# Altium schematic sheet main.SchDoc
size A3; Organization: Altium Limited; Address1: L3, 12a Rodborough Rd; Address2: Frenchs Forest; Address3: NSW; Address4: Australia 2086; SheetNumber: 1; SheetTotal: 1
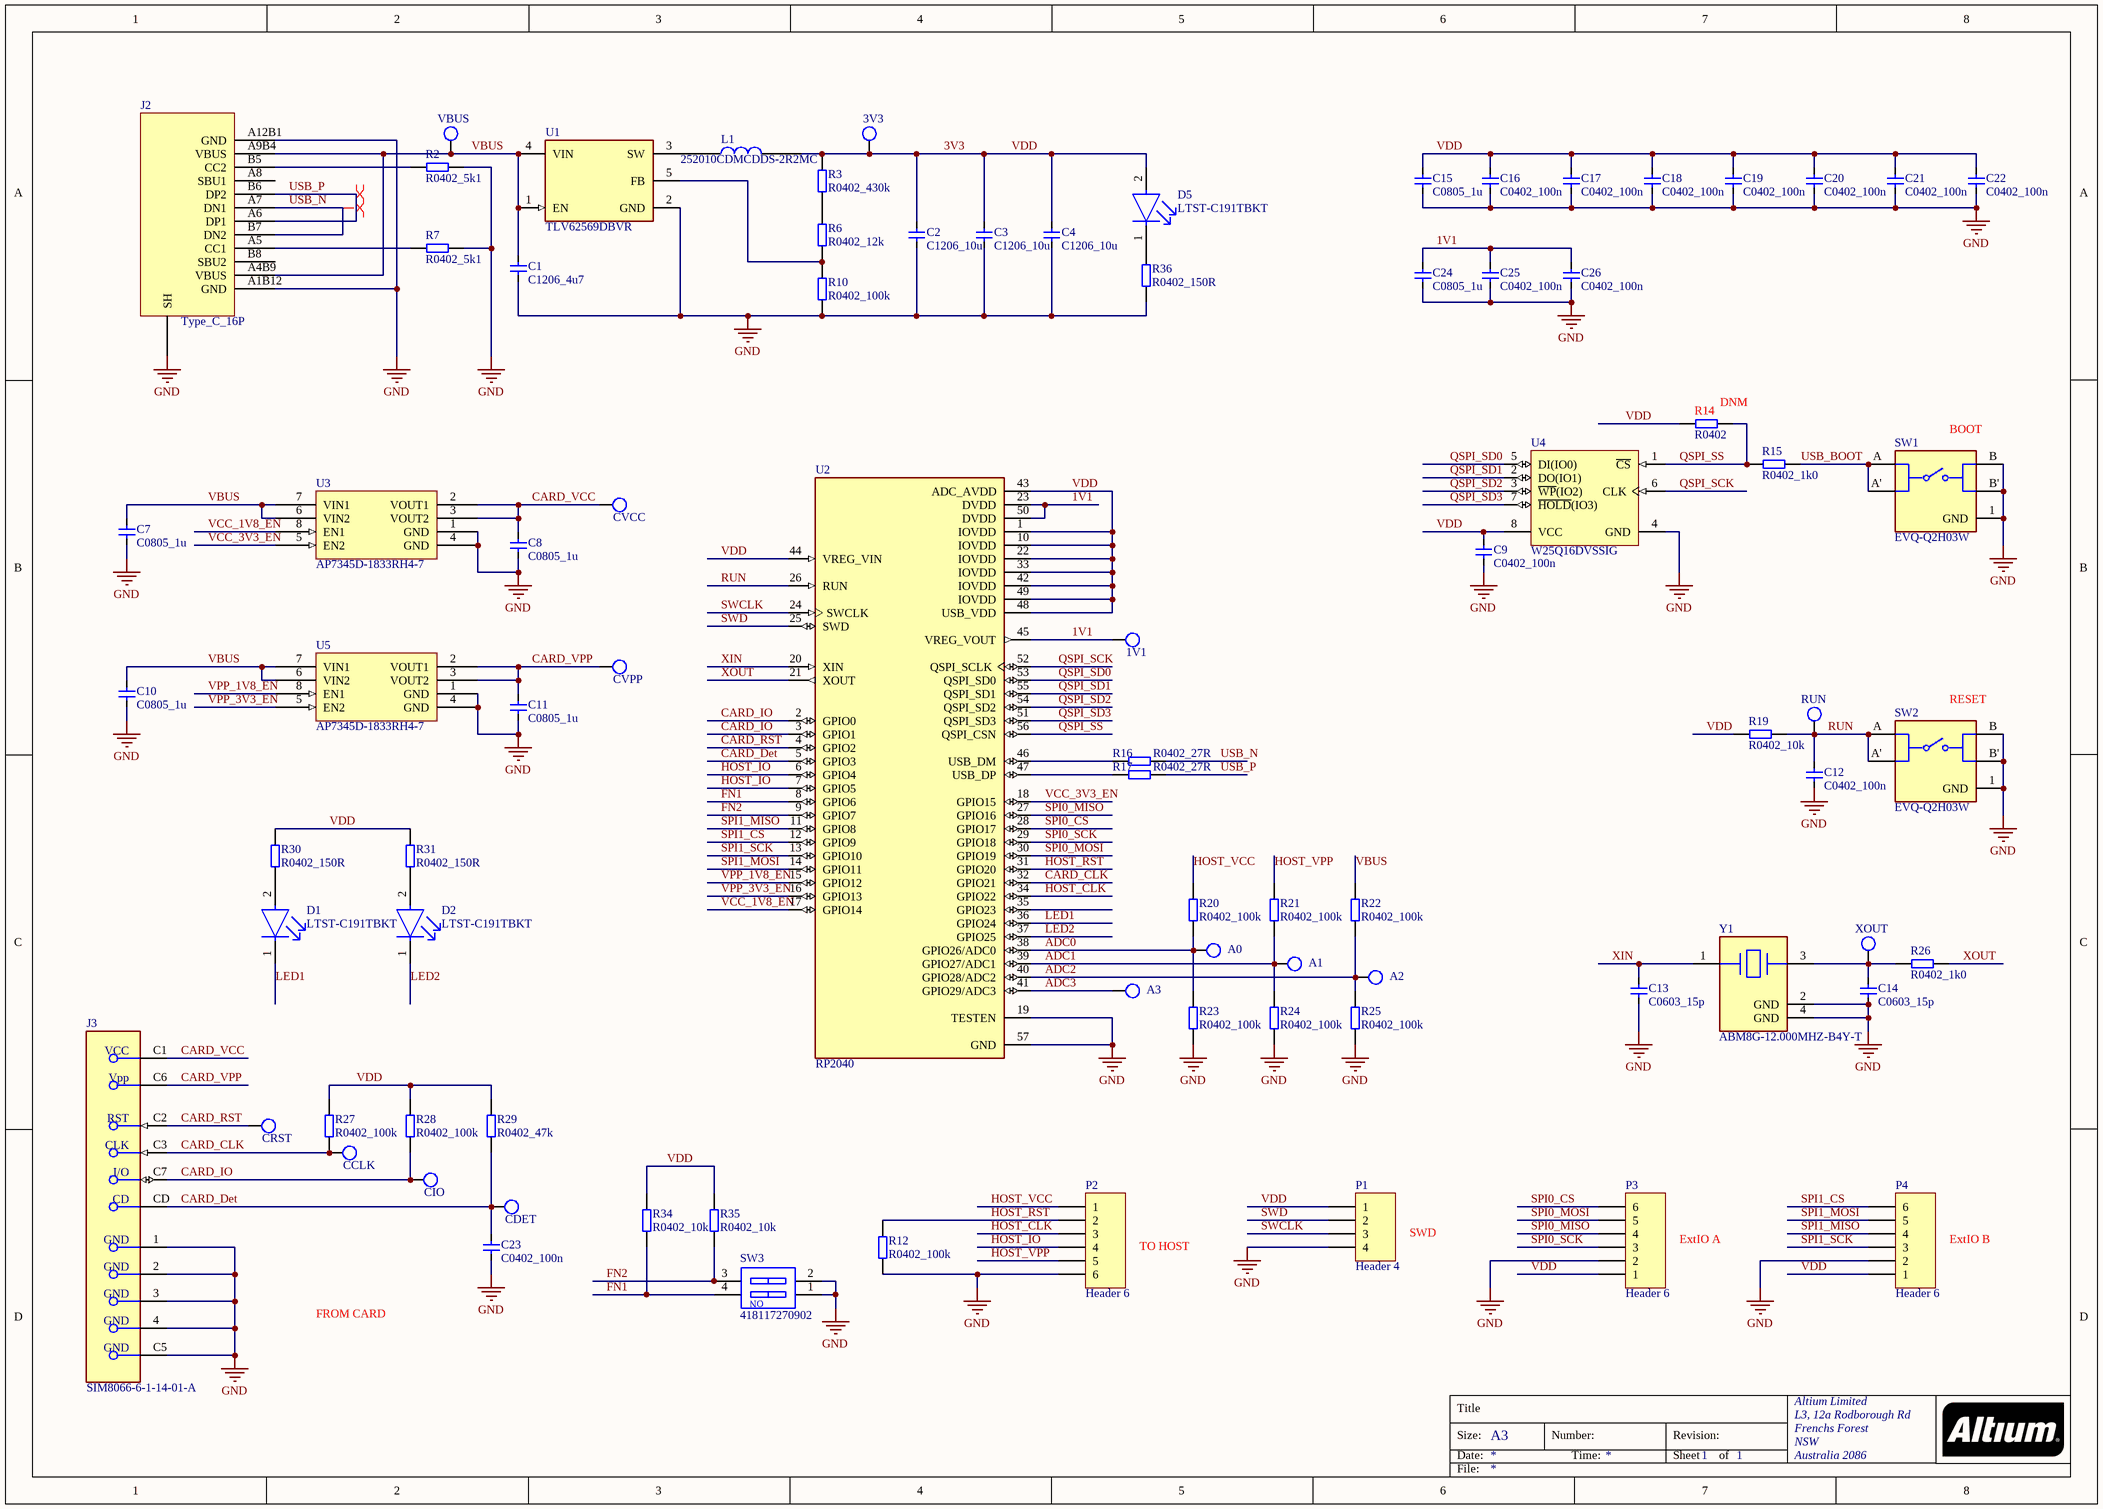
[diagram p0: main.SchDoc]

## Parts
1V1  TestPin 1.2R 0.3R  [TestPin_1.2R_0.3R]  (value not drawn)
3V3  TestPin 1.2R 0.3R  [TestPin_1.2R_0.3R]  (value not drawn)
A0  TestPin 1.2R 0.3R  [TestPin_1.2R_0.3R]  (value not drawn)
A1  TestPin 1.2R 0.3R  [TestPin_1.2R_0.3R]  (value not drawn)
A2  TestPin 1.2R 0.3R  [TestPin_1.2R_0.3R]  (value not drawn)
A3  TestPin 1.2R 0.3R  [TestPin_1.2R_0.3R]  (value not drawn)
C1  C1206_4u7  [C1206]
C2  C1206_10u  [C1206]
C3  C1206_10u  [C1206]
C4  C1206_10u  [C1206]
C7  C0805_1u  [C0805]
C8  C0805_1u  [C0805]
C9  C0402_100n  [C0402]
C10  C0805_1u  [C0805]
C11  C0805_1u  [C0805]
C12  C0402_100n  [C0402]
C13  C0603_15p  [C0603]
C14  C0603_15p  [C0603]
C15  C0805_1u  [C0805]
C16  C0402_100n  [C0402]
C17  C0402_100n  [C0402]
C18  C0402_100n  [C0402]
C19  C0402_100n  [C0402]
C20  C0402_100n  [C0402]
C21  C0402_100n  [C0402]
C22  C0402_100n  [C0402]
C23  C0402_100n  [C0402]
C24  C0805_1u  [C0805]
C25  C0402_100n  [C0402]
C26  C0402_100n  [C0402]
CCLK  TestPin 1.2R 0.3R  [TestPin_1.2R_0.3R]  (value not drawn)
CDET  TestPin 1.2R 0.3R  [TestPin_1.2R_0.3R]  (value not drawn)
CIO  TestPin 1.2R 0.3R  [TestPin_1.2R_0.3R]  (value not drawn)
CRST  TestPin 1.2R 0.3R  [TestPin_1.2R_0.3R]  (value not drawn)
CVCC  TestPin 1.2R 0.3R  [TestPin_1.2R_0.3R]  (value not drawn)
CVPP  TestPin 1.2R 0.3R  [TestPin_1.2R_0.3R]  (value not drawn)
D1  LTST-C191TBKT  [FP-LTST-C191TBKT-MFG]
D2  LTST-C191TBKT  [FP-LTST-C191TBKT-MFG]
D5  LTST-C191TBKT  [FP-LTST-C191TBKT-MFG]
J2  Type_C_16P  [Type_C_16P]
J3  SIM8066-6-1-14-01-A  [FP-SIM8066-6-1-14-01-A-MFG]
L1  252010CDMCDDS-2R2MC  [INDC2520X10N]
P1  Header 4  [HDR1X4]
P2  Header 6  [HDR1X6]
P3  Header 6  [HDR1X6]
P4  Header 6  [HDR1X6]
R2  R0402_5k1  [R0402]
R3  R0402_430k  [R0402]
R6  R0402_12k  [R0402]
R7  R0402_5k1  [R0402]
R10  R0402_100k  [R0402]
R12  R0402_100k  [R0402]
R14  R0402  [R0402]
R15  R0402_1k0  [R0402]
R16  R0402_27R  [R0402]
R17  R0402_27R  [R0402]
R19  R0402_10k  [R0402]
R20  R0402_100k  [R0402]
R21  R0402_100k  [R0402]
R22  R0402_100k  [R0402]
R23  R0402_100k  [R0402]
R24  R0402_100k  [R0402]
R25  R0402_100k  [R0402]
R26  R0402_1k0  [R0402]
R27  R0402_100k  [R0402]
R28  R0402_100k  [R0402]
R29  R0402_47k  [R0402]
R30  R0402_150R  [R0402]
R31  R0402_150R  [R0402]
R34  R0402_10k  [R0402]
R35  R0402_10k  [R0402]
R36  R0402_150R  [R0402]
RUN  TestPin 1.2R 0.3R  [TestPin_1.2R_0.3R]  (value not drawn)
SW1  EVQ-Q2H03W  [FP-EVQ-Q2H03W-MFG]
SW2  EVQ-Q2H03W  [FP-EVQ-Q2H03W-MFG]
SW3  418117270902  [418117270902]
U1  TLV62569DBVR  [FP-DBV0005A-MFG]
U2  RP2040  [QFN40P700X700X90-57N]
U3  AP7345D-1833RH4-7  [SON127P600-8N]
U4  W25Q16DVSSIG  [WINB-W25Q16DVSSIG-8_M]
U5  AP7345D-1833RH4-7  [SON127P600-8N]
VBUS  TestPin 1.2R 0.3R  [TestPin_1.2R_0.3R]  (value not drawn)
XOUT  TestPin 1.2R 0.3R  [TestPin_1.2R_0.3R]  (value not drawn)
Y1  ABM8G-12.000MHZ-B4Y-T  [FP-ABM8G-MFG]

## Nets
GND: C1.2 C2.2 C3.2 C4.2 C7.2 C8.2 C9.2 C10.2 C11.2 C12.2 C13.2 C14.2 C15.2 C16.2 C17.2 C18.2 C19.2 C20.2 C21.2 C22.2 C23.2 C24.2 C25.2 C26.2 J2.0(SH) J2.A1B12(GND) J2.A12B1(GND) J3.1(GND) J3.2(GND) J3.3(GND) J3.4(GND) J3.C5(GND) P1.4 P2.6 P3.2 P4.2 R2.2 R7.2 R10.1 R12.1 R23.1 R24.1 R25.1 R36.1 SW1.1(GND) SW1.B SW1.B' SW2.1(GND) SW2.B SW2.B' SW3.1 SW3.2 U1.2(GND) U2.19(TESTEN) U2.57(GND) U3.1(GND) U3.4(GND) U4.4(GND) U5.1(GND) U5.4(GND) Y1.2(GND) Y1.4(GND)
1V1: 1V1.0 C24.1 C25.1 C26.1 U2.23(DVDD) U2.45(VREG_VOUT) U2.50(DVDD)
3V3: 3V3.0 C2.1 C3.1 C4.1 C9.1 C15.1 C16.1 C17.1 C18.1 C19.1 C20.1 C21.1 C22.1 D5.2(A) L1.2 P1.1 P3.1 P4.1 R3.2 R14.1 R19.1 R27.2 R28.2 R29.2 R30.2 R31.2 R34.2 R35.2 U2.1(IOVDD) U2.10(IOVDD) U2.22(IOVDD) U2.33(IOVDD) U2.42(IOVDD) U2.43(ADC_AVDD) U2.44(VREG_VIN) U2.48(USB_VDD) U2.49(IOVDD) U4.8(VCC)  [also labelled VDD]
ADC0: A0.0 R20.1 R23.2 U2.38(GPIO26/ADC0)
ADC1: A1.0 R21.1 R24.2 U2.39(GPIO27/ADC1)
ADC2: A2.0 R22.1 R25.2 U2.40(GPIO28/ADC2)
ADC3: A3.0 U2.41(GPIO29/ADC3)
CARD_CLK: CCLK.0 J3.C3(CLK) R27.1 U2.32(GPIO21)
CARD_Det: C23.1 CDET.0 J3.CD R29.1 U2.5(GPIO3)
CARD_IO: CIO.0 J3.C7(I/O) R28.1 U2.2(GPIO0) U2.3(GPIO1)
CARD_RST: CRST.0 J3.C2(RST) U2.4(GPIO2)
CARD_VCC: C8.1 CVCC.0 J3.C1(VCC) U3.2(VOUT1) U3.3(VOUT2)
CARD_VPP: C11.1 CVPP.0 J3.C6(Vpp) U5.2(VOUT1) U5.3(VOUT2)
FN1: R34.1 SW3.4 U2.8(GPIO6)
FN2: R35.1 SW3.3 U2.9(GPIO7)
HOST_CLK: P2.3 U2.34(GPIO22)
HOST_IO: P2.4 U2.6(GPIO4) U2.7(GPIO5)
HOST_RST: P2.2 R12.2 U2.31(GPIO20)
HOST_VCC: P2.1 R20.2
HOST_VPP: P2.5 R21.2
LED1: D1.1(C) U2.36(GPIO24)
LED2: D2.1(C) U2.37(GPIO25)
QSPI_SCK: U2.52(QSPI_SCLK) U4.6(CLK)
QSPI_SD0: U2.53(QSPI_SD0) U4.5(DI(IO0))
QSPI_SD1: U2.55(QSPI_SD1) U4.2(DO(IO1))
QSPI_SD2: U2.54(QSPI_SD2) U4.3(~{WP}(IO2))
QSPI_SD3: U2.51(QSPI_SD3) U4.7(~{HOLD}(IO3))
QSPI_SS: R14.2 R15.1 U2.56(QSPI_CSN) U4.1(~{CS})
RUN: C12.1 R19.2 RUN.0 SW2.A SW2.A' U2.26(RUN)
SPI0_CS: P3.6 U2.28(GPIO17)
SPI0_MISO: P3.4 U2.27(GPIO16)
SPI0_MOSI: P3.5 U2.30(GPIO19)
SPI0_SCK: P3.3 U2.29(GPIO18)
SPI1_CS: P4.6 U2.12(GPIO9)
SPI1_MISO: P4.4 U2.11(GPIO8)
SPI1_MOSI: P4.5 U2.14(GPIO11)
SPI1_SCK: P4.3 U2.13(GPIO10)
SWCLK: P1.3 U2.24(SWCLK)
SWD: P1.2 U2.25(SWD)
USB_BOOT: R15.2 SW1.A SW1.A'
USB_N: J2.A7(DN1) J2.B7(DN2) R16.2
USB_P: J2.A6(DP1) J2.B6(DP2) R17.2
VBUS: C1.1 C7.1 C10.1 J2.A4B9(VBUS) J2.A9B4(VBUS) R22.2 U1.1(EN) U1.4(VIN) U3.6(VIN2) U3.7(VIN1) U5.6(VIN2) U5.7(VIN1) VBUS.0
VCC_1V8_EN: U2.17(GPIO14) U3.8(EN1)
VCC_3V3_EN: U2.18(GPIO15) U3.5(EN2)
VPP_1V8_EN: U2.15(GPIO12) U5.8(EN1)
VPP_3V3_EN: U2.16(GPIO13) U5.5(EN2)
XIN: C13.1 U2.20(XIN) Y1.1
XOUT: R26.2 U2.21(XOUT)
NetC14_1: C14.1 R26.1 XOUT.0 Y1.3
NetD1_2: D1.2(A) R30.1
NetD2_2: D2.2(A) R31.1
NetD5_1: D5.1(C) R36.2
NetJ2_A5: J2.A5(CC1) R7.1
NetJ2_B5: J2.B5(CC2) R2.1
NetL1_1: L1.1 U1.3(SW)
NetR3_1: R3.1 R6.2
NetR6_1: R6.1 R10.2 U1.5(FB)
NetR16_1: R16.1 U2.46(USB_DM)
NetR17_1: R17.1 U2.47(USB_DP)

Not connected (* = marked no-connect by the designer): J2 A8(SBU1) B8(SBU2); U2 35(GPIO23)

## Layout directives
differential pair: USB_N, USB_P

## Notes on the sheet
- (near R14) DNM
- (near SW1) BOOT
- (near SW2) RESET
- TO HOST
- SWD
- ExtIO A
- ExtIO B
- FROM CARD
- Title
- Size:
- Date:
- A3
- Number:
- Time:
- Revision:
- Sheet
- of
- File:
- (in symbol CMP-1435-00002-2) ON

## Library data of the parts
C1 = CMP-003-0093-1: Manufacturer 1: Kemet; Manufacturer Part Number 1: C1206C475K4RAC; Voltage Rating DC: 16V; Dielectric: X7R; Tolerance: 0.1%; Hidden Value: C475; Value: 4u7; Component Type: Standard; Part Number: C1206_4u7; Pin Count: 2
C2-C4 = CMP-003-0097-1: Manufacturer 1: Kemet; Manufacturer Part Number 1: C1206C106K4RAC; Value: 10u; Hidden Value: C106; Tolerance: 0.1%; Dielectric: X7R; Voltage Rating DC: 16V; Part Number: C1206_10u; Pin Count: 2; Component Type: Standard
C7 C8 C10 C11 C15 C24 = CMP-003-0085-1: Manufacturer 1: Kemet; Manufacturer Part Number 1: C0805C105K3RAC; Voltage Rating DC: 25V; Dielectric: X7R; Hidden Value: C105; Tolerance: 0.1%; Value: 1u; Component Type: Standard; Pin Count: 2; Part Number: C0805_1u
C9 C12 C16-C23 C25 C26 = CMP-003-0006-1: Manufacturer 1: Kemet; Manufacturer Part Number 1: C0402C104K4RACTU; Dielectric: X7R; Voltage Rating DC: 16V; Value: 100n; Tolerance: 0.1%; Part Number: C0402_100n; Pin Count: 2; Component Type: Standard
C13 C14 = CMP-003-0023-1: Manufacturer 1: Kemet; Manufacturer Part Number 1: C0603C150J1GAC; Voltage Rating DC: 100V; Hidden Value: C150; Dielectric: C0G; Value: 15p; Tolerance: 0.05%; Part Number: C0603_15p; Component Type: Standard; Pin Count: 2
D1 D2 D5 = CMP-22017-000008-1: LED BLUE CLEAR CHIP SMD; Lens Color: Colorless; Dominant Wavelength: 475nm; Forward Current: 20mA; Wavelength: 468nm; Viewing Angle: 130°; Power Dissipation: 76mW; Luminous Intensity: 180mcd; Reverse Voltage: 5V; Number of Elements: 1; Lens Style: Diffused; Forward Voltage: 3.8V; Max Power Dissipation: 75mW; Case Code (Metric): 1608; Packaging: Tape and Reel; Case/Package: 0603; Depth: 1.6mm; Mount: Surface Mount; Lead Free: Lead Free; Min Operating Temperature: -20°C; Lens Transparency: Clear; Illumination Color: Blue; Height: 0.55mm; Test Current: 20mA; Case Code (Imperial): 0603; Max Operating Temperature: 80°C; Number of Pins: 2; Length: 0.8mm; Radiation Hardening: No; Package Quantity: 1; Number of LEDs: 1; Width: 0.8mm; Color: Blue
J3 = CMP-03329-117635865-1: SIM8066-6-1-14-01-A Memory Card Connectors 1.44mm Nano SIM Conn w/Peg and Switch; Current Rating: 1A; Number of Contacts: 6; Voltage Rating: 30V; NexarPartId: 117635865; Number of Pins: 6; Min Operating Temperature: -40°C; Max Operating Temperature: 85°C; Contact Material: Gold, Nickel
L1 = CMP-00003-2: Fixed Ind 2.2UH 2.5A 97 Mohm SMD
P1 = Header 4: Header, 4-Pin; LatestRevisionDate: 17-Jul-2002; LatestRevisionNote: Re-released for DXP Platform.; Publisher: Altium Limited
P2-P4 = Header 6: Header, 6-Pin; LatestRevisionDate: 17-Jul-2002; LatestRevisionNote: Re-released for DXP Platform.; Publisher: Altium Limited
R2 R7 = CMP-004-0436-1: Manufacturer 1: Vishay; Manufacturer Part Number 1: CRCW04025K10FKED; Value: 5k1; Tolerance: 1%; Power Rating: 62,5mW; Pin Count: 2; Component Type: Standard; Part Number: R0402_5k1
R3 = CMP-004-0482-1: Manufacturer Part Number 1: CRCW0402430KFKED; Manufacturer 1: Vishay; Tolerance: 1%; Value: 430k; Power Rating: 62,5mW; Component Type: Standard; Pin Count: 2; Part Number: R0402_430k
R6 = CMP-004-0445-1: Manufacturer 1: Vishay; Manufacturer Part Number 1: CRCW040212K0FKED; Power Rating: 62,5mW; Value: 12k; Tolerance: 1%; Part Number: R0402_12k; Component Type: Standard; Pin Count: 2
R10 R12 R20-R25 R27 R28 = CMP-004-0467-1: Manufacturer Part Number 1: CRCW0402100KFKED; Manufacturer 1: Vishay; Tolerance: 1%; Value: 100k; Power Rating: 62,5mW; Component Type: Standard; Part Number: R0402_100k; Pin Count: 2
R14 = CMP-004-0369-1: Manufacturer 1: Vishay; Manufacturer Part Number 1: CRCW0402____FKED; Power Rating: 62,5mW; Tolerance: 1%; Value: _; Part Number: R0402; Component Type: Standard; Pin Count: 2
R15 R26 = CMP-004-0419-1: Manufacturer 1: Vishay; Manufacturer Part Number 1: CRCW04021K00FKED; Tolerance: 1%; Value: 1k0; Power Rating: 62,5mW; Component Type: Standard; Pin Count: 2; Part Number: R0402_1k0
R16 R17 = CMP-004-0381-1: Manufacturer Part Number 1: CRCW040227R0FKED; Manufacturer 1: Vishay; Value: 27R; Tolerance: 1%; Power Rating: 62,5mW; Pin Count: 2; Part Number: R0402_27R; Component Type: Standard
R19 R34 R35 = CMP-004-0443-1: Manufacturer 1: Vishay; Manufacturer Part Number 1: CRCW040210K0FKED; Power Rating: 62,5mW; Value: 10k; Tolerance: 1%; Part Number: R0402_10k; Component Type: Standard; Pin Count: 2
R29 = CMP-004-0459-1: Manufacturer Part Number 1: CRCW040247K0FKED; Manufacturer 1: Vishay; Power Rating: 62,5mW; Tolerance: 1%; Value: 47k; Part Number: R0402_47k; Component Type: Standard; Pin Count: 2
R30 R31 R36 = CMP-004-0399-1: Manufacturer Part Number 1: CRCW0402150RFKED; Manufacturer 1: Vishay; Value: 150R; Power Rating: 62,5mW; Tolerance: 1%; Part Number: R0402_150R; Component Type: Standard; Pin Count: 2
SW1 SW2 = CMP-05618-000002-1: SWITCH TACTILE SPST-NO 0.02A 15V; Manufacturer: Panasonic Electronic Components; Electromechanical Life: 1000000Cycles; Contact Current Rating: 20mA; Contact Resistance: 100mΩ; Operating Force: 1N; Height: 3.3mm; ComponentLink2URL: https://industrial.panasonic.com/ac/cdn/e/control/switch/light-touch/catalog/sw_lt_eng_6s_th.pdf; Category: Switch; Mouser Description: Switch Tactile ON OFF SPST Round Button J-Bend 0.02A 15VDC 1N SMD Embossed T/R; Mount: Surface Mount; Temperature: -40°C to +85°C; Throw Configuration: SPST-NO; Digikey Description: SWITCH TACTILE SPST-NO 0.02A 15V; Device Class L1: Electromechanical; ComponentLink2Description: Datasheet; Manufacturer Part Number: EVQ-Q2H03W; Device Class L3: Tactile Switches; RoHS: TRUE; Device Class L2: Switches; Temperature Range High: +85°C; Temperature Range Low: -40°C; Octopart: https://octopart.com/evq-q2h03w-panasonic-1368538; Voltage Rating Dc: 15V; Package: 0; Automotive: No; Lead Free: Yes
SW3 = CMP-1435-00002-2: NexarPartId: 22584989; Washable: No; Electrical Life: 2kcycles; Voltage Rating (DC): 24V; Pitch: 2.54mm; Number of Positions: 2; Throw Configuration: SPST; Insulation Resistance: 100MΩ; Mechanical Life: 5kcycles; Current Rating: 25mA; Body Material: Nylon, Polyamide; Mount: Through Hole; Contact Plating: Gold; Voltage Rating: 24V; Length: 6.08mm; Min Operating Temperature: -40°C; RoHS: Compliant; Number of Pins: 2; Max Operating Temperature: 85°C; Termination: PC Pin
U1 = CMP-04918-000387-1: IC REG BUCK ADJ 2A SOT23-5; Output Configuration: Positive; Min Output Voltage: 600mV; Max Output Voltage: 5.5V; Switching Frequency: 1.5MHz; Output Type: Adjustable; Synchronous Rectifier: Yes; Min Input Voltage: 2.5V; Output Current: 2A; Mount: Surface Mount; Min Operating Temperature: -40°C; Max Operating Temperature: 125°C; RoHS Compliant: Yes; Max Input Voltage: 5.5V; Case/Package: SOT-23-5; Packaging: Cut Tape
U2 = CMP-013-000000-1: RP2040 chip for Raspberry Pi Pico - ARM?Cortex?M0+ MCU 32-Bit; MF: Raspberry Pi; Check_prices: https://www.snapeda.com/parts/RP2040/Raspberry+Pi/view-part/?ref=eda; Value: *; SnapEDA_Link: https://www.snapeda.com/parts/RP2040/Raspberry+Pi/view-part/?ref=snap; Pin Count: 57; Source: RP2040.SchLib; Component Type: Standard; MP: RP2040; Design Item ID: RP2040; Package: None
U3 U5 = CMP-00006-1: Active Positive e4 Fixed Linear Voltage Regulator IC -40C~85C TA 300mA 300mA 5.25V
U4 = CMP-2000-05434-1: IC FLASH 16MBIT 104MHZ 8SOIC; Manufacturer: Winbond; Interface Type: Serial(SPI); Rad Hardened: No; Programmable: Yes; Supply Current: 18mA; Number of Words: 2M; Density: 16777216Bit; Word Size: 8b; Sync/Async: Synchronous; Cell Type: NOR; Operating Supply Voltage (Min): 2.7V; Boot Type: Bottom/Top; Address Bus: 24b; Program/Erase Volt (Typ): 2.7to3.6V; Access Time (Max): 7ns; Operating Supply Voltage (Max): 3.6V; Operating Supply Voltage (Typ): 3/3.3V; Mounting: SurfaceMount; Datasheet Version: Rev. D, 10/2012; Manufacturer URL: http://www.winbond.com/hq/index.html?__locale=en; Operating Temperature (Min): -40C; Operating Temperature (Max): 85C; Pin Count: 8; Package Type: SOICW; Datasheet URL: https://ciiva.com/datasheet-click-14728450?src=ciiva&sig=bd4f4644; Operating Temp Range: -40Cto85C; Operating Temperature Classification: Industrial
Y1 = CMP-27762-015546-1: Crystal 12MHz ±30ppm (Tol) ±30ppm (Stability) 10pF FUND 120Ω 4-Pin SMD T/R; ESR (Equivalent Series Resistance): 120R; Height: 1mm; Operating Frequency: 12 MHz; Case/Package: CSMD; Max Operating Temperature: 70°C; Load Capacitance: 10pF; Series: ABM8G; Depth: 2.5mm; Package Quantity: 1000; Frequency: 12MHz; Min Operating Temperature: -20°C; Length: 3.2mm; Termination: SMD/SMT; Frequency Tolerance: 30ppm; Frequency Stability: 30ppm; Tolerance: 30ppm; Lead Free: Lead Free; Number of Pins: 4; Mount: Surface Mount; Width: 2.5mm; Packaging: Tape and Reel